# EAGLE design powerBoard (EAGLE 6.4)
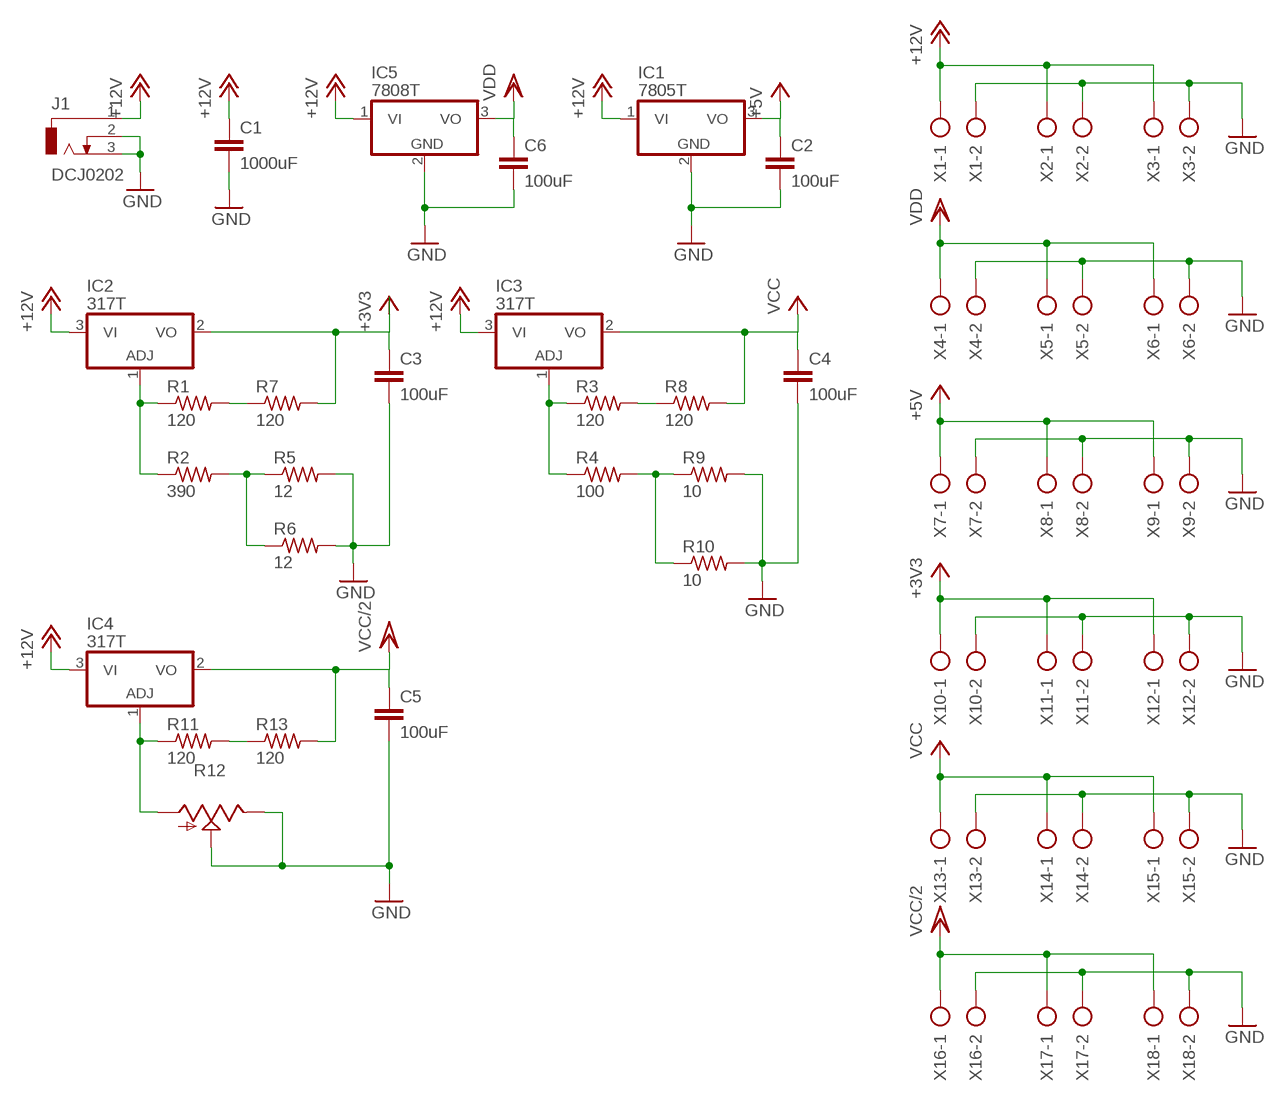
[diagram p0: schematic, sheet 1]

## Parts
C1  1000uF  C5/7.2  [C5B7.2]
C2  100uF  C5/7.2  [C5B7.2]
C3  100uF  C5/7.2  [C5B7.2]
C4  100uF  C5/7.2  [C5B7.2]
C5  100uF  C5/7.2  [C5B7.2]
C6  100uF  C5/7.2  [C5B7.2]
IC1  7805T  [TO220H]
IC2  317T  [TO220H]
IC3  317T  [TO220H]
IC4  317T  [TO220H]
IC5  7808T  [TO220H]
J1  DCJ0202  [DCJ0202]
R1  120  R-US_0207/10  [0207/10]
R2  390  R-US_0207/10  [0207/10]
R3  120  R-US_0207/10  [0207/10]
R4  100  R-US_0207/10  [0207/10]
R5  12  R-US_0207/10  [0207/10]
R6  12  R-US_0207/10  [0207/10]
R7  120  R-US_0207/10  [0207/10]
R8  120  R-US_0207/10  [0207/10]
R9  10  R-US_0207/10  [0207/10]
R10  10  R-US_0207/10  [0207/10]
R11  120  R-US_0207/10  [0207/10]
R12  TRIM_US-RJ9W  [RJ9W]
R13  120  R-US_0207/10  [0207/10]
X1  AK300/2  [AK300/2]
X2  AK300/2  [AK300/2]
X3  AK300/2  [AK300/2]
X4  AK300/2  [AK300/2]
X5  AK300/2  [AK300/2]
X6  AK300/2  [AK300/2]
X7  AK300/2  [AK300/2]
X8  AK300/2  [AK300/2]
X9  AK300/2  [AK300/2]
X10  AK300/2  [AK300/2]
X11  AK300/2  [AK300/2]
X12  AK300/2  [AK300/2]
X13  AK300/2  [AK300/2]
X14  AK300/2  [AK300/2]
X15  AK300/2  [AK300/2]
X16  AK300/2  [AK300/2]
X17  AK300/2  [AK300/2]
X18  AK300/2  [AK300/2]

## Nets
+3V3: C3.1 IC2.2(VO) R7.2 X10.1 X11.1 X12.1
+5V: C2.1 IC1.3(VO) X7.1 X8.1 X9.1
+12V: C1.1 IC1.1(VI) IC2.3(VI) IC3.3(VI) IC4.3(VI) IC5.1(VI) J1.1 X1.1 X2.1 X3.1
GND: C1.2 C2.2 C3.2 C4.2 C5.2 C6.2 IC1.2(GND) IC5.2(GND) J1.2 J1.3 R5.2 R6.2 R9.2 R10.2 R12.E R12.S X1.2 X2.2 X3.2 X4.2 X5.2 X6.2 X7.2 X8.2 X9.2 X10.2 X11.2 X12.2 X13.2 X14.2 X15.2 X16.2 X17.2 X18.2
N$2: IC2.1(ADJ) R1.1 R2.1
N$4: IC3.1(ADJ) R3.1 R4.1
N$5: R2.2 R5.1 R6.1
N$6: R3.2 R8.1
N$7: R1.2 R7.1
N$9: R4.2 R9.1 R10.1
N$12: IC4.1(ADJ) R11.1 R12.A
N$13: R11.2 R13.1
VCC: C4.1 IC3.2(VO) R8.2 X13.1 X14.1 X15.1
VCC/2: C5.1 IC4.2(VO) R13.2 X16.1 X17.1 X18.1
VDD: C6.1 IC5.3(VO) X4.1 X5.1 X6.1

## Library data of the parts
C1-C6 = capacitor-wima:C: CAPACITOR naming: grid - package width
IC1 IC5 = linear:78*: Positive VOLTAGE REGULATOR Source: http://cache.national.com/ds/LM/LM78L05.pdf http://www.fairchildsemi.com/ds/LM/LM7805.pdf
IC2-IC4 = linear:*317: Positive VOLTAGE REGULATOR
J1 = con-jack:DCJ0202: DC POWER JACK Source: DCJ0202.pdf; OC_FARNELL: unknown; OC_NEWARK: unknown
R1-R11 R13 = resistor:R-US_: RESISTOR, American symbol
R12 = pot:TRIM_US-: POTENTIOMETER
X1-X18 = con-ptr500:AK300/2: CONNECTOR; OC_FARNELL: unknown; OC_NEWARK: unknown

## Board
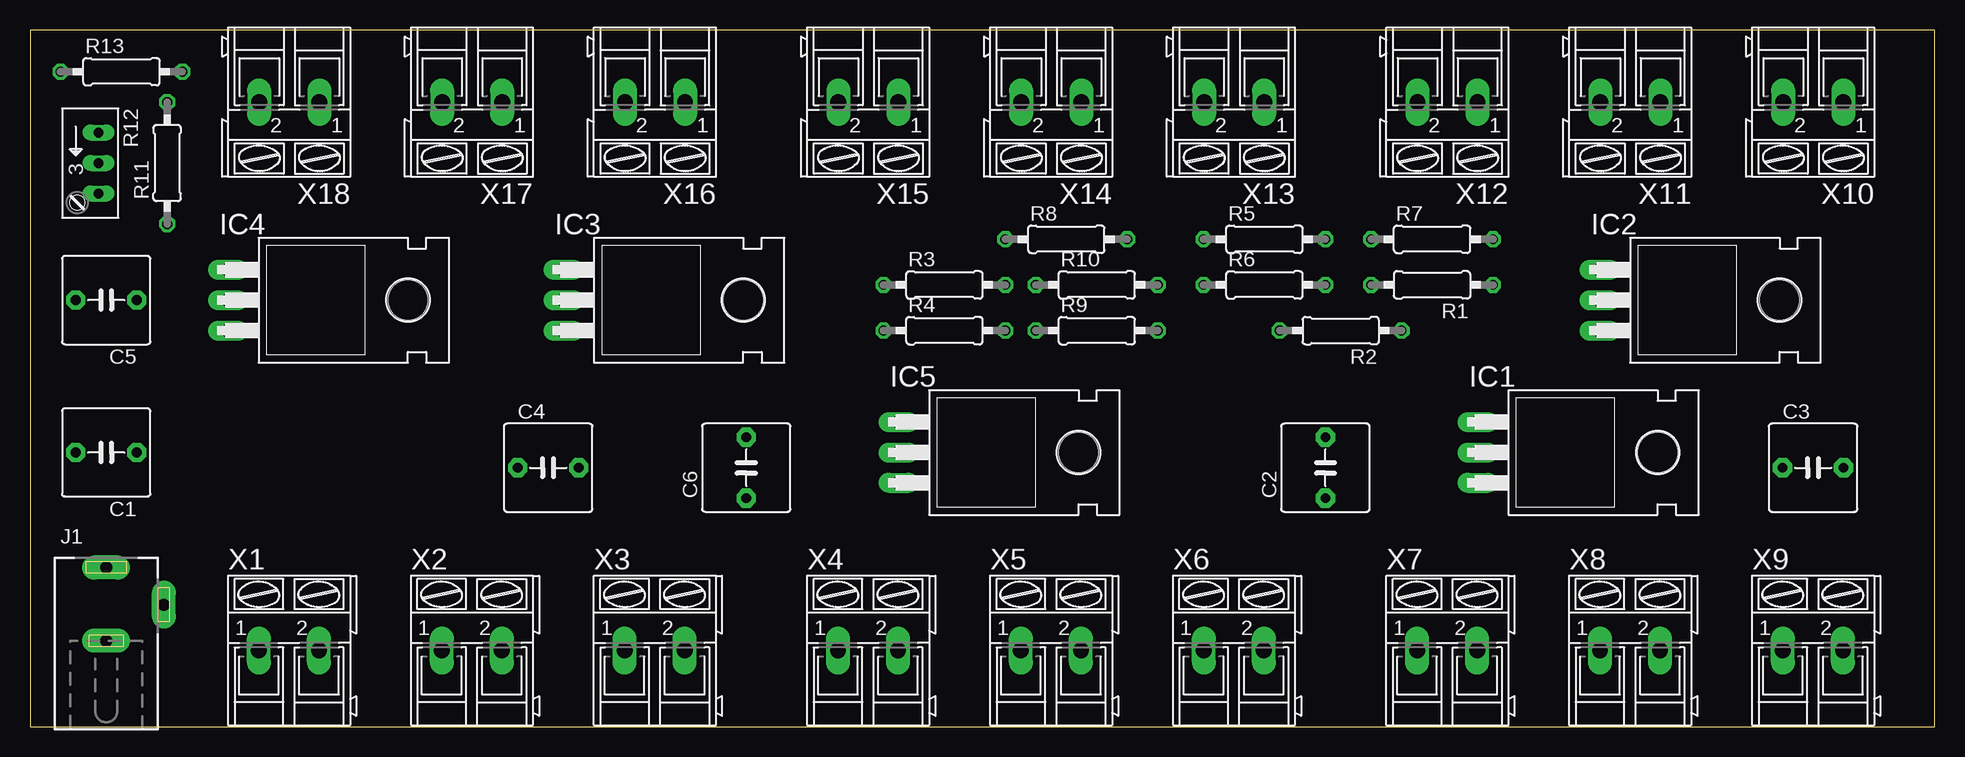
[diagram p1: board, top side]
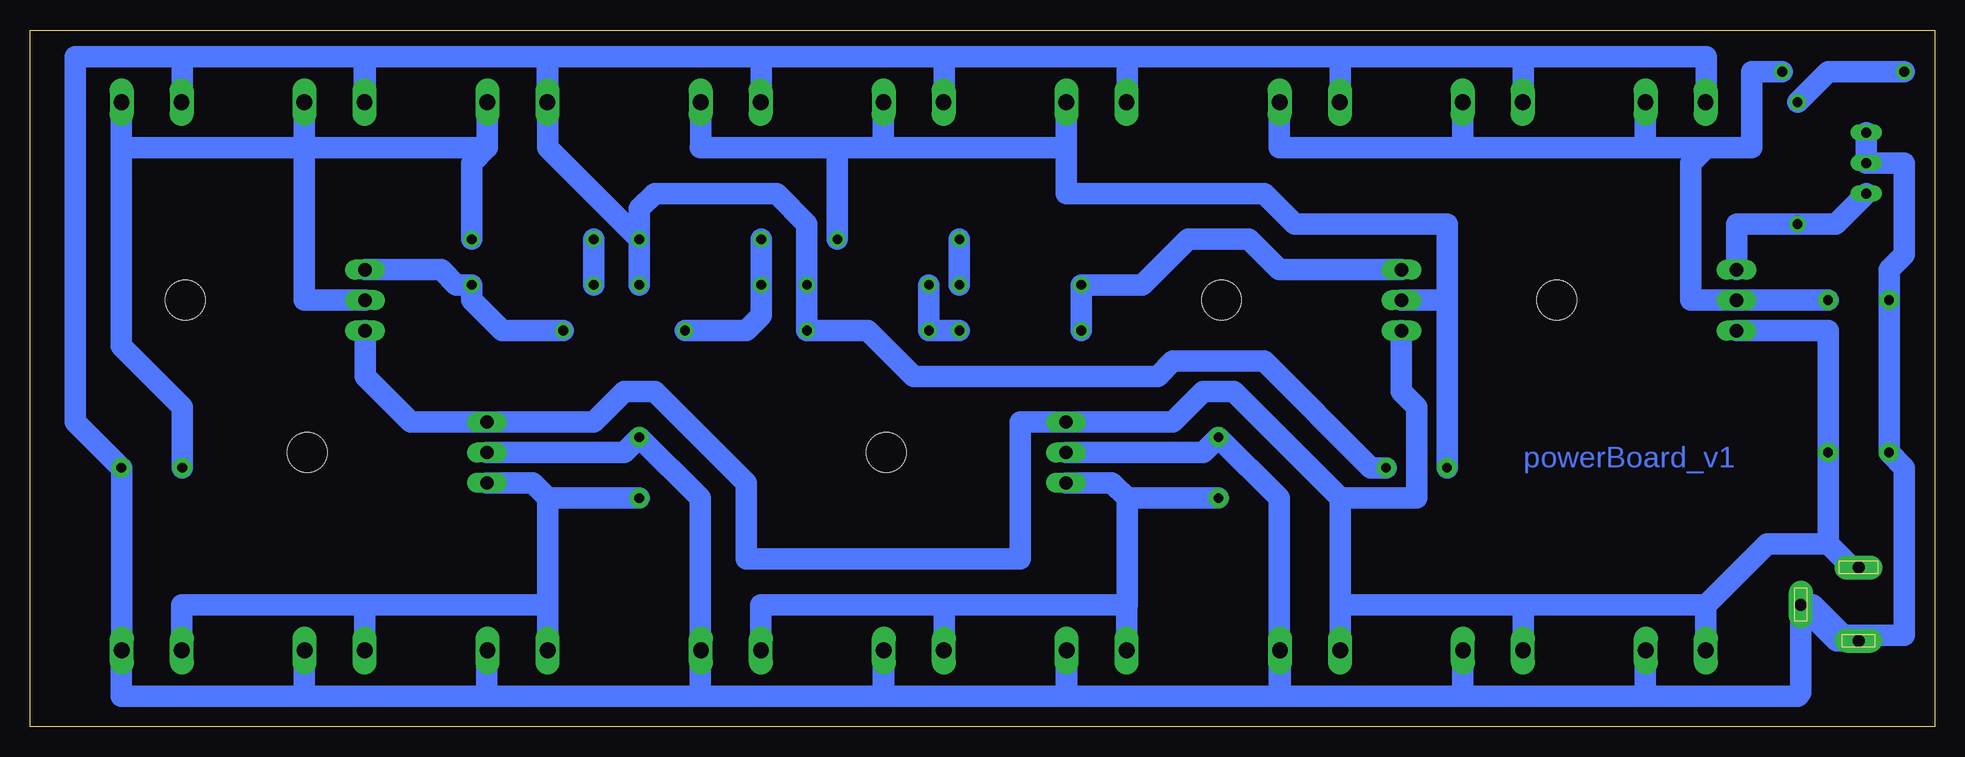
[diagram p2: board, bottom side, seen from below]

Size 158.73 x 58.09 mm. Coordinates in mm from the lower left corner, seen from the top.
Outline: 0,0 158.73,0 158.73,58.09 0,58.09 0,0
Copper layers (1*16): Top 0.035mm / dielectric 1.5mm / Bottom 0.035mm
Design rules "default": minimum track width 10mil, minimum drill 24mil, track to track 8mil, track to pad 8mil, pad to pad 8mil, via to via 8mil, smd to smd 8mil, copper to edge 40mil, drill to drill 8mil, minimum pad ring 10mil, minimum via ring 8mil, stop-mask expansion 4mil, vias tented up to drill 0mil, thermal gap 10mil

### Footprints (pad centres in the part's own frame; a part is rotated, then mirrored left to right if it is on the bottom)
C5B7.2 = drill 0.813 pad 1.6 octagon: 1 -2.54,0; 2 2.54,0
TO220H = drill 1.118 long: 1 -2.54,-10.16; 2 0,-10.16; 3 2.54,-10.16 | hole 3.302: 0,4.826
DCJ0202 = drill 1 pad 2 long: 1 0,3.1; 2 4.8,0; 3 0,-3
0207/10 = drill 0.813 octagon: 1 -5.08,0; 2 5.08,0
RJ9W = drill 0.813 long: A 2.54,0.635; E -2.54,0.635; S 0,0.635
AK300/2 = drill 1.321 long: 1 -2.515,0; 2 2.489,0

### Placement (x,y rotation side)
C1  6.35,22.86 180 top
C2  107.95,21.59 90 top
C3  148.59,21.59 0 top
C4  43.18,21.59 0 top
C5  6.35,35.56 180 top
C6  59.69,21.59 90 top
IC1  130.81,22.86 270 top
IC2  140.97,35.56 270 top
IC3  54.61,35.56 270 top
IC4  26.67,35.56 270 top
IC5  82.55,22.86 270 top
J1  6.35,10.16 0 top
R1  116.84,36.83 180 top
R2  109.22,33.02 180 top
R3  76.2,36.83 0 top
R4  76.2,33.02 0 top
R5  102.87,40.64 0 top
R6  102.87,36.83 0 top
R7  116.84,40.64 0 top
R8  86.36,40.64 0 top
R9  88.9,33.02 0 top
R10  88.9,36.83 0 top
R11  11.43,46.99 90 top
R12  5.08,46.99 270 top
R13  7.62,54.61 0 top
X1  21.59,6.35 0 top
X2  36.83,6.35 0 top
X3  52.07,6.35 0 top
X4  69.85,6.35 0 top
X5  85.09,6.35 0 top
X6  100.33,6.35 0 top
X7  118.11,6.35 0 top
X8  133.35,6.35 0 top
X9  148.59,6.35 0 top
X10  148.59,52.07 180 top
X11  133.35,52.07 180 top
X12  118.11,52.07 180 top
X13  100.33,52.07 180 top
X14  85.09,52.07 180 top
X15  69.85,52.07 180 top
X16  52.07,52.07 180 top
X17  36.83,52.07 180 top
X18  21.59,52.07 180 top

### Tracks (layer width: path | path; a pad name or v marks a point on that pad's centre or on a via)
+3V3
  Bottom 1.778: X12.1 120.62,48.28 120.65,48.26 | 120.65,48.26 135.89,48.26 | 135.89,48.26 135.89,52.05 X11.1 135.87,48.28 135.89,48.26 | 135.89,48.26 151.13,48.26 | 151.13,48.26 151.13,52.05 X10.1 | C3.1 146.05,26.67 151.13,31.75 151.13,48.26 | IC2.2 135.89,35.56 135.89,48.26 | R7.2 121.92,46.99 120.65,48.26
+5V
  Bottom 1.778: X8.1 130.84,10.13 130.81,10.16 | 130.81,10.16 115.57,10.16 | 115.57,10.16 115.57,6.38 X7.1 | X9.1 146.07,10.13 146.05,10.16 130.81,10.16 | IC1.3 116.84,20.32 115.57,19.05 | 115.57,19.05 C2.1 | 115.57,19.05 115.57,10.16
+12V
  Bottom 1.778: 8.89,15.24 C1.1 8.89,33.02 IC4.3 | X1.1 19.07,10.13 19.05,10.16 | 19.05,10.16 34.29,10.16 | 34.29,10.16 34.29,6.38 X2.1 | X3.1 49.55,10.13 49.53,10.16 | 49.53,10.16 34.29,10.16 | J1.1 6.91,13.26 8.89,15.24 | 8.89,15.24 13.97,15.24 19.05,10.16 | 49.53,19.05 58.42,27.94 60.96,27.94 63.5,25.4 IC5.1 76.2,25.4 76.2,13.97 99.06,13.97 99.06,20.32 106.68,27.94 109.22,27.94 111.76,25.4 IC1.1 127,25.4 130.81,29.21 IC2.3 | 49.53,19.05 49.53,10.16 | IC3.3 44.45,27.94 43.18,26.67 43.18,19.05 49.53,19.05
GND
  Bottom 1.778: J1.3 8.15,7.16 J1.2 | J1.2 10.16,10.16 7.62,7.62 2.54,7.62 2.54,21.59 C1.2 C5.2 3.81,38.1 2.54,39.37 2.54,46.99 R12.S R12.E | 39.37,2.54 24.13,2.54 | 24.13,2.54 24.13,6.3 X1.2 | X2.2 39.32,2.59 39.37,2.54 | 39.37,2.54 54.61,2.54 | 54.61,2.54 54.61,6.3 X3.2 | X3.2 54.56,2.59 54.61,2.54 | 54.61,2.54 72.39,2.54 | 72.39,2.54 72.39,6.3 X4.2 72.34,2.59 72.39,2.54 | 72.39,2.54 87.63,2.54 | 87.63,2.54 87.63,6.3 X5.2 87.58,2.59 87.63,2.54 | 87.63,2.54 102.87,2.54 | IC5.2 60.96,22.86 C6.2 54.61,19.05 54.61,6.4 X3.2 | 102.87,2.54 102.87,6.3 X6.2 102.87,6.4 102.87,19.05 C2.2 109.22,22.86 IC1.2 | 102.87,2.54 120.65,2.54 | 120.65,2.54 120.65,6.3 | 120.65,6.3 X7.2 120.65,6.35 120.65,6.3 | 120.65,2.54 135.89,2.54 | 135.89,2.54 135.89,6.3 | 135.89,6.3 X8.2 135.89,6.35 135.89,6.3 | 135.89,2.54 151.13,2.54 151.13,6.3 X9.2 151.08,21.59 C3.2 154.94,25.4 154.94,55.88 146.05,55.88 | X12.2 115.62,55.83 115.57,55.88 | 115.57,55.88 130.81,55.88 | 130.81,55.88 130.81,52.12 X11.2 130.86,55.83 130.81,55.88 | 130.81,55.88 146.05,55.88 | 146.05,55.88 146.05,52.12 X10.2 | J1.2 11.15,2.82 11.43,2.54 24.13,2.54 | X12.2 115.57,52.07 | 115.57,52.07 115.57,55.88 | 97.79,55.88 115.57,55.88 | X13.2 97.79,52.07 97.79,55.88 | X14.2 82.55,52.07 82.55,55.88 | 82.55,55.88 97.79,55.88 | X15.2 67.31,52.07 67.31,55.88 | 67.31,55.88 82.55,55.88 | X16.2 49.53,52.07 49.53,55.88 | 49.53,55.88 67.31,55.88 | X17.2 34.29,52.07 34.29,55.88 | 34.29,55.88 49.53,55.88 | X18.2 19.05,52.07 19.05,55.88 34.29,55.88 | 115.57,52.02 115.57,48.26 R5.2 | 115.57,52.02 X12.2 | R6.2 R5.2 | 115.57,52.02 115.57,52.07 | R5.2 107.95,43.18 106.68,44.45 96.52,44.45 93.98,41.91 R10.2 R9.2 88.9,33.02 85.09,29.21 64.77,29.21 63.5,30.48 55.88,30.48 46.99,21.59 C4.2
N$2
  Bottom 1.778: IC2.1 124.46,38.1 123.19,36.83 R1.1 121.92,35.56 119.38,33.02 R2.1
N$4
  Bottom 1.778: R4.1 R3.1 66.04,36.83 62.23,40.64 57.15,40.64 54.61,38.1 IC3.1
N$5
  Bottom 1.778: R5.1 R6.1 97.79,34.29 99.06,33.02 R2.2
N$6
  Bottom 1.778: R3.2 R8.1
N$7
  Bottom 1.778: R7.1 R1.2
N$9
  Bottom 1.778: R10.1 R9.1 R4.2
N$12
  Bottom 1.778: IC4.1 16.51,41.91 R11.1 8.26,41.91 R12.A
N$13
  Bottom 1.778: R13.1 8.89,54.61 R11.2
VCC
  Bottom 1.778: X14.1 87.63,52.07 87.63,48.26 | 87.63,48.26 91.44,48.26 | 91.44,48.26 102.84,48.26 | 102.87,48.26 102.84,48.26 | 102.84,48.26 X13.1 | X15.1 72.39,52.07 72.39,48.26 | 72.39,48.26 87.63,48.26 | R8.2 91.44,48.26 | IC3.2 40.64,35.56 | 40.64,35.56 40.64,41.91 53.34,41.91 55.88,44.45 72.39,44.45 72.39,48.26 | C4.1 40.64,35.56
VCC/2
  Bottom 1.778: X16.1 54.61,52.07 54.61,48.26 39.34,48.26 | 39.34,48.26 X17.1 | X18.1 24.13,52.07 24.13,48.26 | 24.13,48.26 39.34,48.26 | R13.2 15.24,54.61 15.24,48.26 19.05,48.26 | 19.05,48.26 24.13,48.26 | C5.1 IC4.2 20.32,35.56 20.32,46.99 19.05,48.26
VDD
  Bottom 1.778: X4.1 67.33,10.13 67.31,10.16 | 67.31,10.16 82.55,10.16 | 82.55,10.16 82.55,6.38 X5.1 | X6.1 97.81,10.13 97.79,10.16 82.55,10.16 | IC5.3 68.58,20.32 67.31,19.05 | 67.31,19.05 67.31,10.16 | 67.31,19.05 C6.1

### Text on the board
Bottom: powerBoard_v1